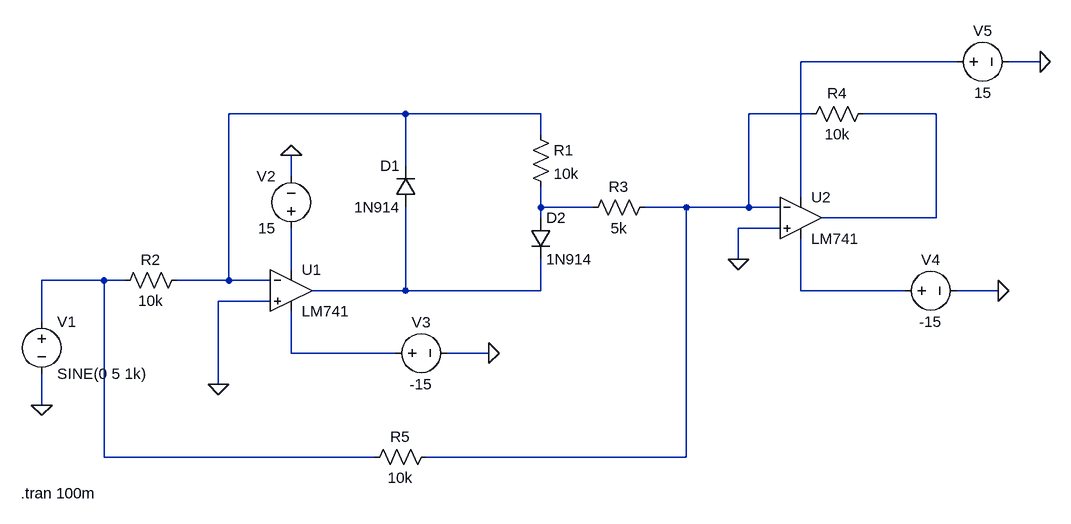
[diagram p0: schematic Hassas_tam_dalga_LM741.asc]
Hassas_tam_dalga_LM741.asc, the LTspice schematic file:
Version 4
SHEET 1 1428 680
WIRE 1280 -160 1040 -160
WIRE 1408 -160 1360 -160
WIRE 432 -80 160 -80
WIRE 640 -80 432 -80
WIRE 1056 -80 960 -80
WIRE 1248 -80 1136 -80
WIRE 640 -48 640 -80
WIRE 432 0 432 -80
WIRE 256 16 256 -16
WIRE 1040 48 1040 -160
WIRE 640 64 640 32
WIRE 720 64 640 64
WIRE 864 64 800 64
WIRE 960 64 960 -80
WIRE 960 64 864 64
WIRE 1008 64 960 64
WIRE 640 80 640 64
WIRE 1248 80 1248 -80
WIRE 1248 80 1072 80
WIRE 1008 96 944 96
WIRE 944 144 944 96
WIRE 256 160 256 96
WIRE -32 176 -128 176
WIRE 0 176 -32 176
WIRE 160 176 160 -80
WIRE 160 176 80 176
WIRE 224 176 160 176
WIRE 432 192 432 64
WIRE 432 192 288 192
WIRE 640 192 640 144
WIRE 640 192 432 192
WIRE 1040 192 1040 112
WIRE 1200 192 1040 192
WIRE 1344 192 1280 192
WIRE 224 208 144 208
WIRE -128 240 -128 176
WIRE 256 288 256 224
WIRE 416 288 256 288
WIRE 560 288 496 288
WIRE 144 336 144 208
WIRE -128 368 -128 320
WIRE -32 448 -32 176
WIRE 384 448 -32 448
WIRE 864 448 864 64
WIRE 864 448 464 448
FLAG 144 336 0
FLAG 944 144 0
FLAG 256 -16 0
FLAG 560 288 0
FLAG -128 368 0
FLAG 1344 192 0
FLAG 1408 -160 0
SYMBOL OpAmps\\LM741 256 128 R0
SYMATTR InstName U1
SYMBOL voltage -128 224 R0
WINDOW 123 0 0 Left 0
WINDOW 39 0 0 Left 0
SYMATTR InstName V1
SYMATTR Value SINE(0 5 1k)
SYMBOL diode 448 64 R180
WINDOW 0 24 64 Left 2
WINDOW 3 24 0 Left 2
SYMATTR InstName D1
SYMATTR Value 1N914
SYMBOL diode 624 80 R0
SYMATTR InstName D2
SYMATTR Value 1N914
SYMBOL res 624 -64 R0
SYMATTR InstName R1
SYMATTR Value 10k
SYMBOL res 96 160 R90
WINDOW 0 0 56 VBottom 2
WINDOW 3 32 56 VTop 2
SYMATTR InstName R2
SYMATTR Value 10k
SYMBOL res 816 48 R90
WINDOW 0 0 56 VBottom 2
WINDOW 3 32 56 VTop 2
SYMATTR InstName R3
SYMATTR Value 5k
SYMBOL OpAmps\\LM741 1040 16 R0
SYMATTR InstName U2
SYMBOL res 1152 -96 R90
WINDOW 0 0 56 VBottom 2
WINDOW 3 32 56 VTop 2
SYMATTR InstName R4
SYMATTR Value 10k
SYMBOL res 480 432 R90
WINDOW 0 0 56 VBottom 2
WINDOW 3 32 56 VTop 2
SYMATTR InstName R5
SYMATTR Value 10k
SYMBOL voltage 256 112 R180
WINDOW 0 24 96 Left 2
WINDOW 3 24 16 Left 2
WINDOW 123 0 0 Left 0
WINDOW 39 0 0 Left 0
SYMATTR InstName V2
SYMATTR Value 15
SYMBOL voltage 400 288 R270
WINDOW 0 32 56 VTop 2
WINDOW 3 -32 56 VBottom 2
WINDOW 123 0 0 Left 0
WINDOW 39 0 0 Left 0
SYMATTR InstName V3
SYMATTR Value -15
SYMBOL voltage 1184 192 R270
WINDOW 0 32 56 VTop 2
WINDOW 3 -32 56 VBottom 2
WINDOW 123 0 0 Left 0
WINDOW 39 0 0 Left 0
SYMATTR InstName V4
SYMATTR Value -15
SYMBOL voltage 1264 -160 R270
WINDOW 0 32 56 VTop 2
WINDOW 3 -32 56 VBottom 2
WINDOW 123 0 0 Left 0
WINDOW 39 0 0 Left 0
SYMATTR InstName V5
SYMATTR Value 15
TEXT -160 504 Left 2 !.tran 100m

The netlist it stands for:
* Hassas_tam_dalga_LM741.asc
XU1 0 N002 N006 N010 N008 LM741  ; pins In+ In- V+ V- OUT
V1 N007 0 SINE(0 5 1k)
D1 N008 N002 1N914
D2 N005 N008 1N914
R1 N002 N005 10k
R2 N002 N007 10k
R3 N003 N005 5k
XU2 0 N003 N001 N009 N004 LM741  ; pins In+ In- V+ V- OUT
R4 N004 N003 10k
R5 N003 N007 10k
V2 N006 0 15
V3 N010 0 -15
V4 N009 0 -15
V5 N001 0 15
.model D D
.lib standard.dio
.tran 100m
.lib LM741.lib
.backanno
.end